# EAGLE design MegaBotv2 (EAGLE 9.6.2)
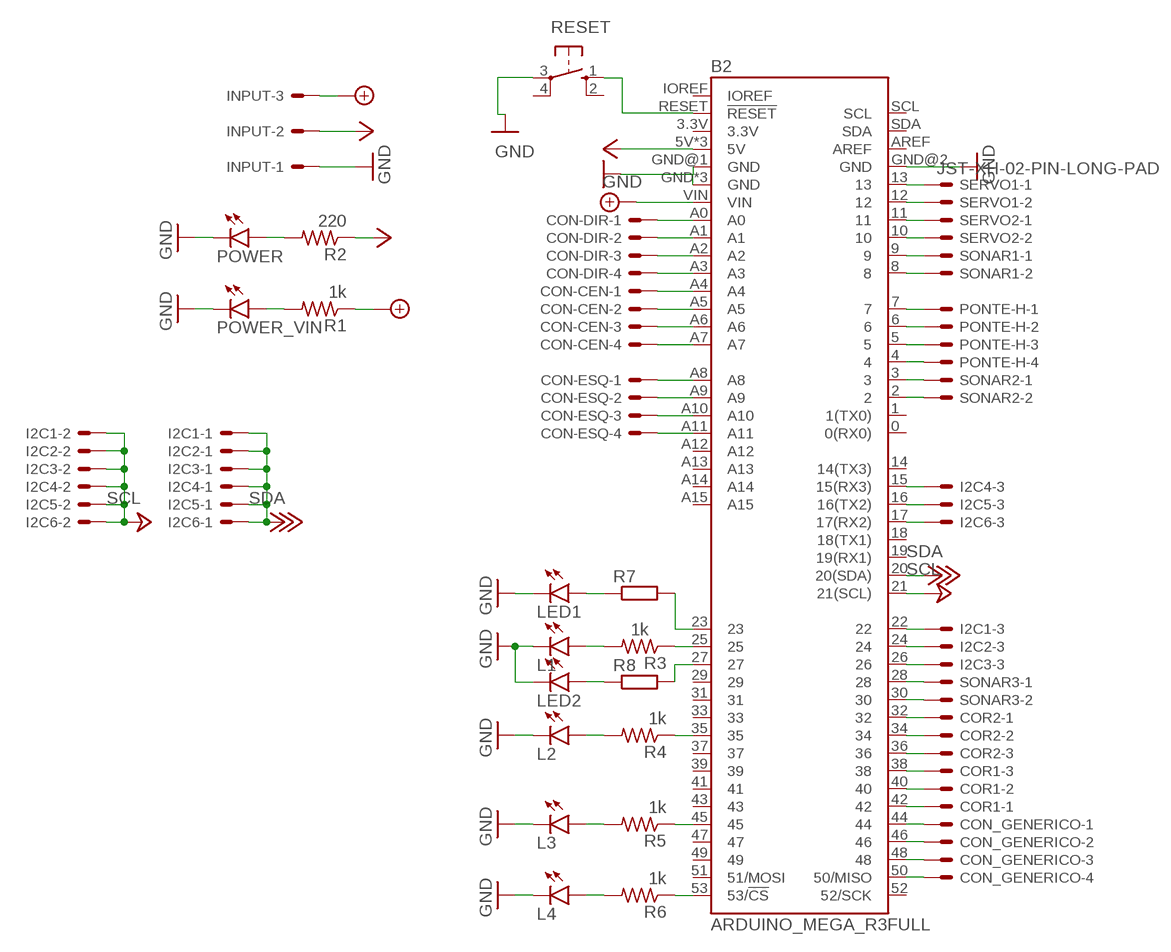
[diagram p0: schematic, sheet 1]

## Parts
B2  ARDUINO_MEGA_R3FULL  [ARDUINO_MEGA_NO_SILK]
CON-CEN  JST-XH-04-PIN-LONG-PAD  [JST-XH-04-PACKAGE-LONG-PAD]
CON-DIR  JST-XH-04-PIN-LONG-PAD  [JST-XH-04-PACKAGE-LONG-PAD]
CON-ESQ  JST-XH-04-PIN-LONG-PAD  [JST-XH-04-PACKAGE-LONG-PAD]
CON_GENERICO  JST-XH-04-PIN-LONG-PAD  [JST-XH-04-PACKAGE-LONG-PAD]
COR1  JST-XH-03-PIN-LONG-PAD  [JST-XH-03-PACKAGE-LONG-PAD]
COR2  JST-XH-03-PIN-LONG-PAD  [JST-XH-03-PACKAGE-LONG-PAD]
I2C1  JST-XH-03-PIN-LONG-PAD  [JST-XH-03-PACKAGE-LONG-PAD]
I2C2  JST-XH-03-PIN-LONG-PAD  [JST-XH-03-PACKAGE-LONG-PAD]
I2C3  JST-XH-03-PIN-LONG-PAD  [JST-XH-03-PACKAGE-LONG-PAD]
I2C4  JST-XH-03-PIN-LONG-PAD  [JST-XH-03-PACKAGE-LONG-PAD]
I2C5  JST-XH-03-PIN-LONG-PAD  [JST-XH-03-PACKAGE-LONG-PAD]
I2C6  JST-XH-03-PIN-LONG-PAD  [JST-XH-03-PACKAGE-LONG-PAD]
INPUT  KK-156-3  [KK-156-3]
L1  LEDLED5MM_LONG_PAD  [LED5MM_LONG_PAD]
L2  LEDLED5MM_LONG_PAD  [LED5MM_LONG_PAD]
L3  LEDLED5MM_LONG_PAD  [LED5MM_LONG_PAD]
L4  LEDLED5MM_LONG_PAD  [LED5MM_LONG_PAD]
LED1  LEDKA-3528ASYC  [KA-3528ASYC]
LED2  LEDKA-3528ASYC  [KA-3528ASYC]
PONTE-H  JST-XH-04-PIN-LONG-PAD  [JST-XH-04-PACKAGE-LONG-PAD]
POWER  LEDLED5MM_LONG_PAD  [LED5MM_LONG_PAD]
POWER_VIN  LEDLED5MM_LONG_PAD  [LED5MM_LONG_PAD]
R1  1k  R-US_0204/7  [0204/7]
R2  220  R-US_0204/7  [0204/7]
R3  1k  R-US_0204/7  [0204/7]
R4  1k  R-US_0204/7  [0204/7]
R5  1k  R-US_0204/7  [0204/7]
R6  1k  R-US_0204/7  [0204/7]
R7  R-EU_M0805  [M0805]
R8  R-EU_M0805  [M0805]
RESET  10-XX  [B3F-10XX]
SERVO1  JST-XH-02-PIN-LONG-PAD  [JST-XH-02-PACKAGE-LONG-PAD]
SERVO2  JST-XH-02-PIN-LONG-PAD  [JST-XH-02-PACKAGE-LONG-PAD]
SONAR1  JST-XH-02-PIN-LONG-PAD  [JST-XH-02-PACKAGE-LONG-PAD]
SONAR2  JST-XH-02-PIN-LONG-PAD  [JST-XH-02-PACKAGE-LONG-PAD]
SONAR3  JST-XH-02-PIN-LONG-PAD  [JST-XH-02-PACKAGE-LONG-PAD]

## Nets
+8V: B2.VIN INPUT.3 R1.1
+18V: B2.20(20(SDA)) I2C1.1 I2C2.1 I2C3.1 I2C4.1 I2C5.1 I2C6.1 ; supply symbol labelled SDA
+24V: B2.21(21(SCL)) I2C1.2 I2C2.2 I2C3.2 I2C4.2 I2C5.2 I2C6.2 ; supply symbol labelled SCL
GND: B2.GND B2.GND@1(GND) B2.GND@2(GND) B2.GND@3(GND) B2.GND@4(GND) INPUT.1 L1.K(C) L2.K(C) L3.K(C) L4.K(C) LED1.C LED2.C POWER.K(C) POWER_VIN.K(C) RESET.3(P)
N$1: B2.7 PONTE-H.1
N$2: B2.6 PONTE-H.2
N$3: B2.5 PONTE-H.3
N$4: B2.4 PONTE-H.4
N$5: B2.A1 CON-DIR.2
N$6: B2.A2 CON-DIR.3
N$7: B2.A3 CON-DIR.4
N$8: B2.A4 CON-CEN.1
N$9: B2.A5 CON-CEN.2
N$10: B2.A6 CON-CEN.3
N$11: B2.A0 CON-DIR.1
N$12: B2.A7 CON-CEN.4
N$13: B2.A8 CON-ESQ.1
N$14: B2.A9 CON-ESQ.2
N$15: B2.A10 CON-ESQ.3
N$16: B2.A11 CON-ESQ.4
N$17: B2.11 SERVO2.1
N$18: B2.10 SERVO2.2
N$19: B2.9 SONAR1.1
N$20: B2.8 SONAR1.2
N$21: B2.22 I2C1.3
N$22: B2.24 I2C2.3
N$23: B2.26 I2C3.3
N$24: B2.15(15(RX3)) I2C4.3
N$25: B2.16(16(TX2)) I2C5.3
N$26: B2.17(17(RX2)) I2C6.3
N$27: B2.13 SERVO1.1
N$28: B2.12 SERVO1.2
N$29: POWER_VIN.A R1.2
N$30: B2.32 COR2.1
N$31: B2.34 COR2.2
N$32: POWER.A R2.2
N$33: B2.36 COR2.3
N$34: B2.38 COR1.3
N$35: B2.40 COR1.2
N$36: B2.42 COR1.1
N$37: L1.A R3.2
N$38: L2.A R4.2
N$39: L3.A R5.2
N$40: L4.A R6.2
N$41: B2.25 R3.1
N$42: B2.35 R4.1
N$43: B2.45 R5.1
N$44: B2.53(53/!CS) R6.1
N$45: B2.RESET(!RESET) RESET.1(S)
N$46: B2.3 SONAR2.1
N$47: B2.2 SONAR2.2
N$48: B2.28 SONAR3.1
N$49: B2.30 SONAR3.2
N$50: B2.44 CON_GENERICO.1
N$51: B2.46 CON_GENERICO.2
N$52: B2.48 CON_GENERICO.3
N$53: B2.50(50/MISO) CON_GENERICO.4
N$54: LED1.A R7.1
N$55: B2.23 R7.2
N$56: B2.27 R8.2
N$57: LED2.A R8.1
VCC: B2.5V B2.5V@1(5V) B2.5V@2(5V) INPUT.2 R2.1
Unconnected: B2.0(0(RX0)) B2.1(1(TX0)) B2.3.3V B2.14(14(TX3)) B2.18(18(TX1)) B2.19(19(RX1)) B2.29 B2.31 B2.33 B2.37 B2.39 B2.41 B2.43 B2.47 B2.49 B2.51(51/MOSI) B2.52(52/SCK) B2.A12 B2.A13 B2.A14 B2.A15 B2.AREF B2.IOREF B2.SCL B2.SDA RESET.2(S1) RESET.4(P1)

## Library data of the parts
B2 = SparkFun-Boards:ARDUINO_MEGA_R3: Arduino Mega R3 ATmega2560 R3 compatible footprint. SparkFun Products: Arduino Mega 2560 R3 <https://www.sparkfun.com/products/11061>
CON-CEN CON-DIR CON-ESQ CON_GENERICO PONTE-H = Rembrandt Electronics - JST XH Connectors v1-0:JST-XH-04-PIN: JST XH Connector 2 Pin Wire to board connector. Pitch: 2,54 mm, (0.100") Number of pins: 4 Created by Rembrandt Electronics www.rembrandtelectronics.com
COR1 COR2 I2C1-I2C6 = Rembrandt Electronics - JST XH Connectors v1-0:JST-XH-03-PIN: JST XH Connector 2 Pin Wire to board connector. Pitch: 2,54 mm, (0.100") Number of pins: 3 Created by Rembrandt Electronics www.rembrandtelectronics.com
INPUT = con-molex:KK-156-3: KK 156 HEADER Source: http://www.molex.com/pdm_docs/sd/026604100_sd.pdf; MF: MOLEX; OC_FARNELL: unknown; OC_NEWARK: unknown
L1-L4 POWER POWER_VIN = led_robotica:LED: LED OSRAM: - CHIPLED LG R971, LG N971, LY N971, LG Q971, LY Q971, LO R971, LY R971 LH N974, LH R974 LS Q976, LO Q976, LY Q976 LO Q996 - Hyper CHIPLED LW Q18S LB Q993, LB Q99A, LB R99A - SideLED LS A670, LO A670, LY A670, LG A670, LP A670 LB A673, LV A673, LT A673, LW A673 LH A674 LY A675 LS A676, LA A676, LO A676, LY A676, LW A676 LS A679, LY A679, LG A679 - Hyper Micro SIDELED® LS Y876, LA Y876, LO Y876, LY Y876 LT Y87S - SmartLED LW L88C, LW L88S LB L89C, LB L89S, LG L890 LS L89K, LO L89K, LY L89K LS L896, LA L896, LO L896, LY L896 - TOPLED LS T670, LO T670, LY T670, LG T670, LP T670 LSG T670, LSP T670, LSY T670, LOP T670, LYG T670 LG T671, LOG T671, LSG T671 LB T673, LV T673, LT T673, LW T673 LH T674 LS T676, LA T676, LO T676, LY T676, LB T676, LH T676, LSB T676, LW T676 LB T67C, LV T67C, LT T67C, LS T67K, LO T67K, LY T67K, LW E67C LS E67B, LA E67B, LO E67B, LY E67B, LB E67C, LV E67C, LT E67C LW T67C LS T679, LY T679, LG T679 LS T770, LO T770, LY T770, LG T770, LP T770 LB T773, LV T773, LT T773, LW T773 LH T774 LS E675, LA E675, LY E675, LS T675 LS T776, LA T776, LO T776, LY T776, LB T776 LHGB T686 LT T68C, LB T68C - Hyper Mini TOPLED® LB M676 - Mini TOPLED Santana® LG M470 LS M47K, LO M47K, LY M47K Source: http://www.osram.convergy.de LUXEON: - LUMILED® LXK2-PW12-R00, LXK2-PW12-S00, LXK2-PW14-U00, LXK2-PW14-V00 LXK2-PM12-R00, LXK2-PM12-S00, LXK2-PM14-U00 LXK2-PE12-Q00, LXK2-PE12-R00, LXK2-PE12-S00, LXK2-PE14-T00, LXK2-PE14-U00 LXK2-PB12-K00, LXK2-PB12-L00, LXK2-PB12-M00, LXK2-PB14-N00, LXK2-PB14-P00, LXK2-PB14-Q00 LXK2-PR12-L00, LXK2-PR12-M00, LXK2-PR14-Q00, LXK2-PR14-R00 LXK2-PD12-Q00, LXK2-PD12-R00, LXK2-PD12-S00 LXK2-PH12-R00, LXK2-PH12-S00 LXK2-PL12-P00, LXK2-PL12-Q00, LXK2-PL12-R00 Source: www.luxeon.com KINGBRIGHT: KA-3528ASYC Source: www.kingbright.com
LED1 LED2 = led:LED: LED OSRAM: - CHIPLED LG R971, LG N971, LY N971, LG Q971, LY Q971, LO R971, LY R971 LH N974, LH R974 LS Q976, LO Q976, LY Q976 LO Q996 - Hyper CHIPLED LW Q18S LB Q993, LB Q99A, LB R99A - SideLED LS A670, LO A670, LY A670, LG A670, LP A670 LB A673, LV A673, LT A673, LW A673 LH A674 LY A675 LS A676, LA A676, LO A676, LY A676, LW A676 LS A679, LY A679, LG A679 - Hyper Micro SIDELED® LS Y876, LA Y876, LO Y876, LY Y876 LT Y87S - SmartLED LW L88C, LW L88S LB L89C, LB L89S, LG L890 LS L89K, LO L89K, LY L89K LS L896, LA L896, LO L896, LY L896 - TOPLED LS T670, LO T670, LY T670, LG T670, LP T670 LSG T670, LSP T670, LSY T670, LOP T670, LYG T670 LG T671, LOG T671, LSG T671 LB T673, LV T673, LT T673, LW T673 LH T674 LS T676, LA T676, LO T676, LY T676, LB T676, LH T676, LSB T676, LW T676 LB T67C, LV T67C, LT T67C, LS T67K, LO T67K, LY T67K, LW E67C LS E67B, LA E67B, LO E67B, LY E67B, LB E67C, LV E67C, LT E67C LW T67C LS T679, LY T679, LG T679 LS T770, LO T770, LY T770, LG T770, LP T770 LB T773, LV T773, LT T773, LW T773 LH T774 LS E675, LA E675, LY E675, LS T675 LS T776, LA T776, LO T776, LY T776, LB T776 LHGB T686 LT T68C, LB T68C - Hyper Mini TOPLED® LB M676 - Mini TOPLED Santana® LG M470 LS M47K, LO M47K, LY M47K Source: http://www.osram.convergy.de LUXEON: - LUMILED® LXK2-PW12-R00, LXK2-PW12-S00, LXK2-PW14-U00, LXK2-PW14-V00 LXK2-PM12-R00, LXK2-PM12-S00, LXK2-PM14-U00 LXK2-PE12-Q00, LXK2-PE12-R00, LXK2-PE12-S00, LXK2-PE14-T00, LXK2-PE14-U00 LXK2-PB12-K00, LXK2-PB12-L00, LXK2-PB12-M00, LXK2-PB14-N00, LXK2-PB14-P00, LXK2-PB14-Q00 LXK2-PR12-L00, LXK2-PR12-M00, LXK2-PR14-Q00, LXK2-PR14-R00 LXK2-PD12-Q00, LXK2-PD12-R00, LXK2-PD12-S00 LXK2-PH12-R00, LXK2-PH12-S00 LXK2-PL12-P00, LXK2-PL12-Q00, LXK2-PL12-R00 Source: www.luxeon.com KINGBRIGHT: KA-3528ASYC Source: www.kingbright.com
R1-R6 = rcl_robotica:R-US_: RESISTOR, American symbol; SPICEPREFIX: R
R7 R8 = rcl:R-EU_: RESISTOR, European symbol; SPICEPREFIX: R
RESET = switch-omron:10-XX: OMRON SWITCH; MPN: B3F-1000; OC_FARNELL: 176432; OC_NEWARK: 36M3542
SERVO1 SERVO2 SONAR1-SONAR3 = Rembrandt Electronics - JST XH Connectors v1-0:JST-XH-02-PIN: JST XH Connector 2 Pin Wire to board connector. Pitch: 2,54 mm, (0.100") Number of pins: 2 Created by Rembrandt Electronics www.rembrandtelectronics.com

## Board
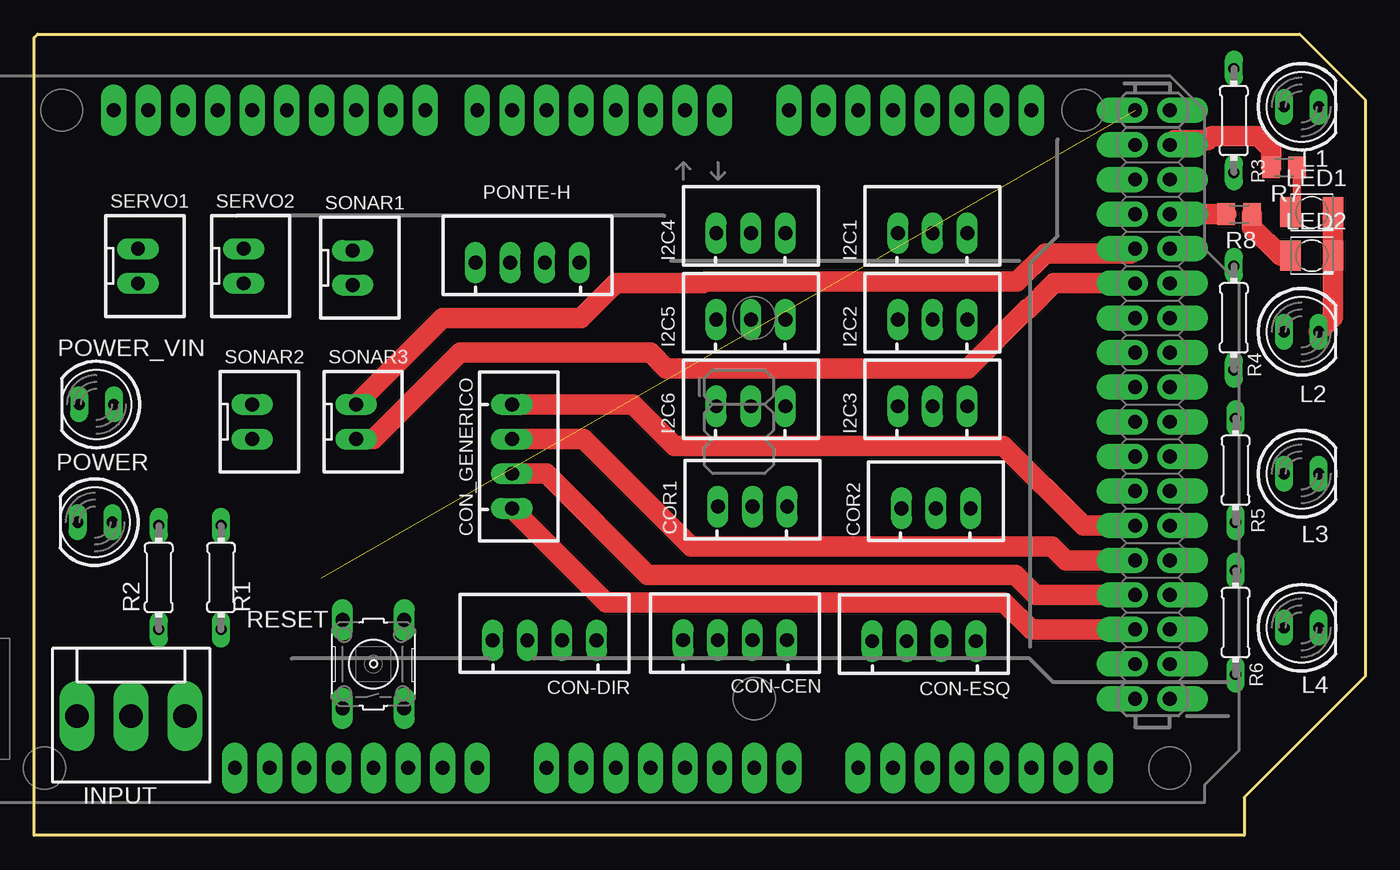
[diagram p1: board, top side]
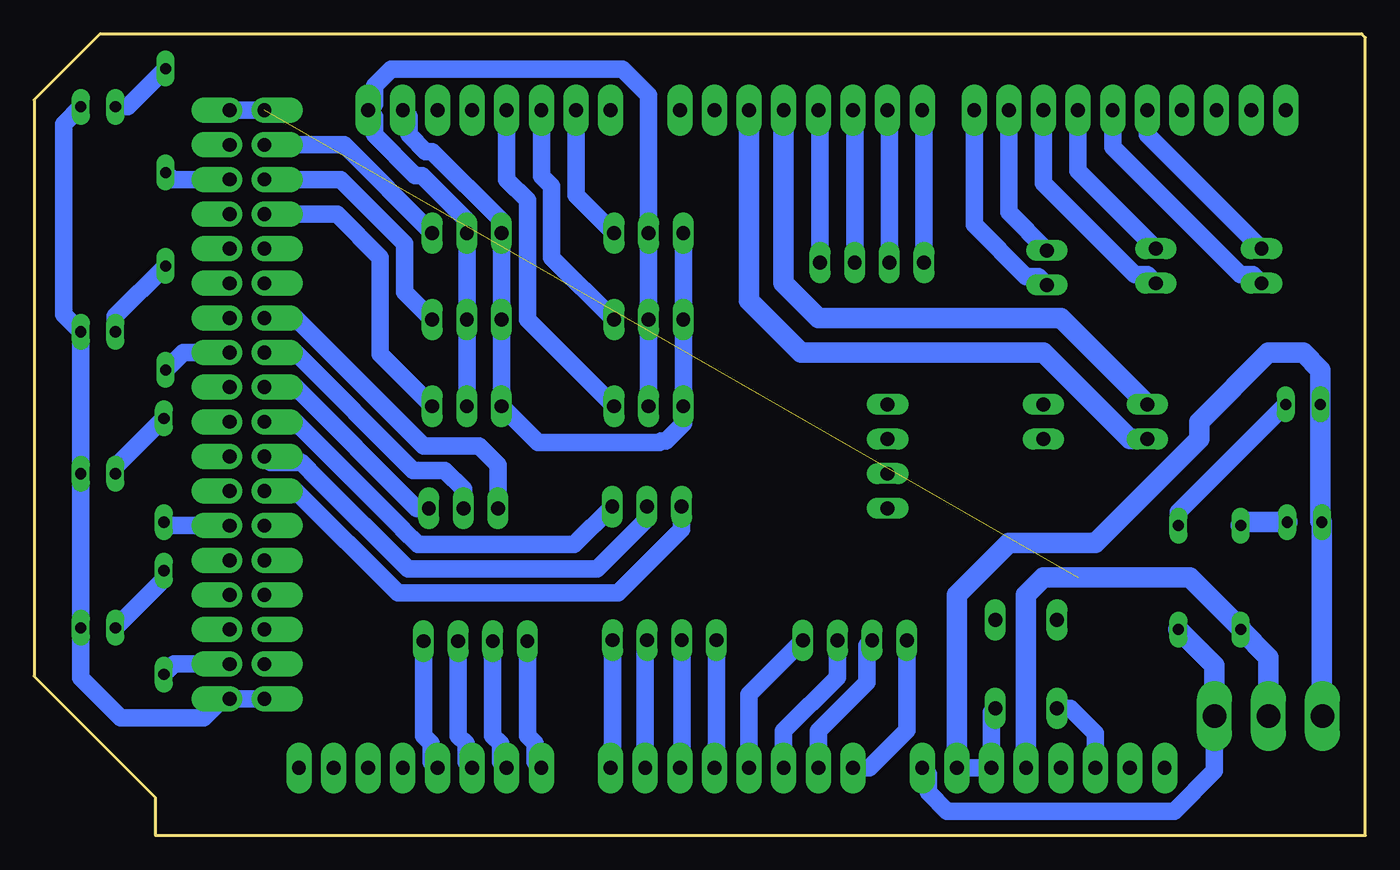
[diagram p2: board, bottom side, seen from below]

Size 97.66 x 58.8 mm. Coordinates in mm from the lower left corner, seen from the top.
Outline: 0,0 0,58.55 0.25,58.8 92.84,58.8 97.66,53.98 97.66,11.68 88.77,2.79 88.77,0 0,0
Copper layers (1*16): Top 0.035mm / dielectric 1.5mm / Bottom 0.035mm
Design rules "default *": minimum track width 0.032259375mm, minimum drill 0.35mm, track to track 20mil, track to pad 20mil, pad to pad 20mil, via to via 20mil, smd to smd 6mil, copper to edge 40mil, drill to drill 6mil, minimum pad ring 10mil, minimum via ring 8mil, stop-mask expansion 4mil, vias tented up to drill 0mil, thermal gap 10mil

### Footprints (pad centres in the part's own frame; a part is rotated, then mirrored left to right if it is on the bottom)
ARDUINO_MEGA_NO_SILK = drill 1.016 pad 1.88 long: 0 13.97,24.13; 1 11.43,24.13; 2 8.89,24.13; 3 6.35,24.13; 3.3V -13.97,-24.13; 4 3.81,24.13; 5 1.27,24.13; 5V -11.43,-24.13; 6 -1.27,24.13; 7 -3.81,24.13; 8 -7.62,24.13; 9 -10.16,24.13; 10 -12.7,24.13; 11 -15.24,24.13; 12 -17.78,24.13; 13 -20.32,24.13; 14 19.05,24.13; 15 21.59,24.13; 16 24.13,24.13; 17 26.67,24.13; 18 29.21,24.13; 19 31.75,24.13; 20 34.29,24.13; 21 36.83,24.13; A0 1.27,-24.13; A1 3.81,-24.13; A2 6.35,-24.13; A3 8.89,-24.13; A4 11.43,-24.13; A5 13.97,-24.13; A6 16.51,-24.13; A7 19.05,-24.13; A8 24.13,-24.13; A9 26.67,-24.13; A10 29.21,-24.13; A11 31.75,-24.13; A12 34.29,-24.13; A13 36.83,-24.13; A14 39.37,-24.13; A15 41.91,-24.13; AREF -25.4,24.13; GND -8.89,-24.13; GND@1 -6.35,-24.13; GND@4 -22.86,24.13; IOREF -19.05,-24.13; NC -21.59,-24.13; RESET -16.51,-24.13; SCL -30.48,24.13; SDA -27.94,24.13; VIN -3.81,-24.13 | drill 1.016 pad 1.88 offset: 5V@1 44.45,24.13; 5V@2 46.99,24.13; 22 44.45,21.59; 23 46.99,21.59; 24 44.45,19.05; 25 46.99,19.05; 26 44.45,16.51; 27 46.99,16.51; 28 44.45,13.97; 29 46.99,13.97; 30 44.45,11.43; 31 46.99,11.43; 32 44.45,8.89; 33 46.99,8.89; 34 44.45,6.35; 35 46.99,6.35; 36 44.45,3.81; 37 46.99,3.81; 38 44.45,1.27; 39 46.99,1.27; 40 44.45,-1.27; 41 46.99,-1.27; 42 44.45,-3.81; 43 46.99,-3.81; 44 44.45,-6.35; 45 46.99,-6.35; 46 44.45,-8.89; 47 46.99,-8.89; 48 44.45,-11.43; 49 46.99,-11.43; 50 44.45,-13.97; 51 46.99,-13.97; 52 44.45,-16.51; 53 46.99,-16.51; GND@2 44.45,-19.05; GND@3 46.99,-19.05
JST-XH-04-PACKAGE-LONG-PAD = drill 1.016 long: 1 -3.81,0; 2 -1.27,0; 3 1.27,0; 4 3.81,0
JST-XH-03-PACKAGE-LONG-PAD = drill 1.016 long: 1 -2.54,0; 2 0,0; 3 2.54,0
KK-156-3 = drill 1.7 pad 2.184 long: 1 -3.96,0; 2 0,0; 3 3.96,0
LED5MM_LONG_PAD = drill 0.813 long: A -1.27,0; K 1.27,0
KA-3528ASYC = smd 1.5 x 2.2: A -1.55,0; C 1.55,0
0204/7 = drill 0.813 long: 1 -3.81,0; 2 3.81,0
M0805 = smd 1.3 x 1.6: 1 -0.95,0; 2 0.95,0
B3F-10XX = drill 1.016 long: 1 -3.251,2.261; 2 3.251,2.261; 3 -3.251,-2.261; 4 3.251,-2.261
JST-XH-02-PACKAGE-LONG-PAD = drill 1.016 long: 1 -1.27,0; 2 1.27,0

### Placement (x,y rotation side)
B2  36.32,29.08 0 top
CON-CEN  51.42,14.33 0 top
CON-DIR  37.45,14.31 0 top
CON-ESQ  65.29,14.26 0 top
CON_GENERICO  35.05,27.81 270 top
COR1  52.7,24.13 0 top
COR2  66.17,24 0 top
I2C1  65.91,44.2 0 top
I2C2  65.91,37.85 0 top
I2C3  65.91,31.5 0 top
I2C4  52.58,44.2 0 top
I2C5  52.58,37.85 0 top
I2C6  52.58,31.5 0 top
INPUT  7.11,8.76 0 top
L1  92.96,53.47 0 top
L2  92.96,36.96 0 top
L3  92.96,26.54 0 top
L4  92.96,15.24 0 top
LED1  93.73,45.72 0 top
LED2  93.73,42.55 0 top
PONTE-H  36.2,42.04 0 top
POWER  4.47,22.99 180 top
POWER_VIN  4.57,31.62 180 top
R1  13.72,18.92 90 top
R2  9.14,18.92 90 top
R3  88.01,52.45 90 top
R4  88.01,37.97 90 top
R5  88.14,26.8 90 top
R6  88.14,15.62 90 top
R7  91.69,49.02 180 top
R8  88.39,45.59 180 top
RESET  24.89,12.57 90 top
SERVO1  7.62,41.78 270 top
SERVO2  15.37,41.78 270 top
SONAR1  23.37,41.66 270 top
SONAR2  16,30.35 270 top
SONAR3  23.62,30.35 270 top

### Tracks (layer width: path | path; a pad name or v marks a point on that pad's centre or on a via)
+8V
  Bottom 1.27: B2.VIN 32.06,4.5 32.06,3.15 30.68,1.78 14.02,1.78 11.07,4.73 INPUT.3
  Bottom 1.5: R1.1 11.07,12.47 INPUT.3
+18V
  Bottom 1.27: I2C4.1 I2C5.1 I2C6.1 50.04,30.23 51.31,28.96 51.66,28.96 51.79,28.83 60.71,28.83 I2C3.1 I2C2.1 I2C1.1 63.37,45.11 68.45,50.19 68.94,50.19 70.16,51.41 70.16,52.76 B2.20
+24V
  Bottom 1.27: I2C3.2 I2C2.2 I2C1.2 65.91,45.11 69.21,48.41 69.7,48.41 72.7,51.41 72.7,52.76 B2.21 72.7,53.67 72.7,55.02 71.48,56.24 54.51,56.24 52.58,54.3 I2C4.2 I2C5.2 I2C6.2
GND
  Top 1.5: LED1.C LED2.C 95.28,38 L2.K
  Bottom 1.27: B2.GND@2 B2.GND@3 83.82,10.03 85.22,8.64 91.31,8.64 94.23,11.56 L4.K L3.K L2.K 95.5,38.23 95.5,52.2 L1.K | B2.GND@1 B2.GND 27.43,9.04 RESET.3 | 3.2,31.52 POWER_VIN.K
  Bottom 1.5: B2.GND@1 29.97,17.65 26.16,21.46 19.81,21.46 12.19,29.08 12.19,30.35 7.11,35.43 4.57,35.43 3.3,34.16 POWER_VIN.K 3.3,23.09 POWER.K 3.2,8.81 INPUT.1
N$1
  Bottom 1.27: B2.7 32.39,53.09 PONTE-H.1
N$2
  Bottom 1.27: B2.6 34.92,53.09 PONTE-H.2
N$3
  Bottom 1.27: B2.5 37.47,53.09 PONTE-H.3
N$4
  Bottom 1.27: B2.4 40,53.09 PONTE-H.4
N$5
  Bottom 1.27: CON-DIR.2 36.56,13.93 36.56,11.24 40.13,7.67 B2.A1
N$6
  Bottom 1.27: CON-DIR.3 38.72,11.62 42.67,7.67 B2.A2
N$7
  Bottom 1.27: CON-DIR.4 45.21,10.36 B2.A3
N$8
  Bottom 1.27: B2.A4 47.61,5.1 CON-CEN.1
N$9
  Bottom 1.27: CON-CEN.2 50.15,5.1 B2.A5
N$10
  Bottom 1.27: CON-CEN.3 52.83,14.19 B2.A6
N$11
  Bottom 1.27: CON-DIR.1 33.64,7.71 36.4,4.95 B2.A0
N$12
  Bottom 1.27: CON-CEN.4 55.23,5.1 B2.A7
N$13
  Bottom 1.27: B2.A8 60.91,5.41 60.91,6.76 61.48,7.32 CON-ESQ.1
N$14
  Bottom 1.27: B2.A9 63.45,5.41 63.45,6.76 64.02,7.32 CON-ESQ.2
N$15
  Bottom 1.27: B2.A10 65.99,5.41 65.99,6.76 66.56,7.32 CON-ESQ.3
N$16
  Bottom 1.27: B2.A11 68.53,5.41 68.53,6.76 69.1,7.32 CON-ESQ.4
N$17
  Bottom 1.27: B2.11 21.08,48.77 SERVO2.1
N$18
  Bottom 1.27: SERVO2.2 16,41.15 16.92,41.15 23.62,47.85 B2.10
N$19
  Bottom 1.27: B2.9 26.16,45.72 SONAR1.1
N$20
  Bottom 1.27: SONAR1.2 24,41.02 24.92,41.02 28.7,44.8 B2.8
N$21
  Bottom 1.27: I2C1.3 74.93,50.67 B2.22
N$22
  Bottom 1.27: I2C2.3 70.48,39.88 70.48,43.43 75.18,48.13 B2.24
N$23
  Bottom 1.27: I2C3.3 72.26,35.31 72.26,42.42 75.44,45.59 B2.26
N$24
  Bottom 1.27: B2.15 57.91,46.99 I2C4.3
N$25
  Bottom 1.27: B2.16 60.45,48.39 59.69,47.62 59.69,42.42 I2C5.3
N$26
  Bottom 1.27: B2.17 62.99,48.13 61.47,46.61 61.47,37.85 I2C6.3
N$27
  Bottom 1.27: B2.13 16,51.44 SERVO1.1
N$28
  Bottom 1.27: SERVO1.2 8.25,41.15 9.17,41.15 18.54,50.52 B2.12
N$29
  Bottom 1.27: R1.2 13.72,23.75 POWER_VIN.A
N$30
  Bottom 1.27: COR2.1 63.63,27.18 65.03,28.58 69.09,28.58 78.49,37.97 B2.32
N$31
  Bottom 1.27: COR2.2 66.17,25.43 67.54,26.8 69.85,26.8 78.49,35.43 B2.34
N$32
  Bottom 1.5: POWER.A 8.89,22.99 R2.2
N$33
  Bottom 1.27: COR2.3 69.6,24 78.49,32.89 B2.36
N$34
  Bottom 1.27: COR1.3 58.04,21.34 69.5,21.34 70.61,22.45 70.61,22.51 78.46,30.35 B2.38
N$35
  Bottom 1.27: COR1.2 52.7,23.21 56.36,19.56 70.23,19.56 76.81,26.14 78.03,27.36 80.31,27.36 B2.40
N$36
  Bottom 1.27: COR1.1 50.17,22.45 54.84,17.78 70.97,17.78 78.46,25.27 B2.42
N$37
  Bottom 1.27: R3.2 90.81,53.47 L1.A
N$38
  Bottom 1.27: R4.2 91.69,38.1 L2.A
N$39
  Bottom 1.27: R5.2 91.69,27.05 L3.A
N$40
  Bottom 1.27: L4.A 88.14,18.8 R6.2
N$41
  Bottom 1.27: R3.1 87.5,48.13 B2.25
N$42
  Bottom 1.27: R4.1 86.74,35.43 B2.35
N$43
  Bottom 1.27: B2.45 87.88,22.73 R5.1
N$44
  Bottom 1.27: B2.53 87.38,12.57 R6.1
N$45
  Bottom 1.27: B2.RESET 19.81,7.49 21.64,9.32 RESET.1
N$46
  Bottom 1.5: B2.3 42.67,40.51 40.13,37.97 22.35,37.97 SONAR2.1
N$47
  Bottom 1.5: B2.2 45.21,39.24 41.4,35.43 23.62,35.43 17.27,29.08 SONAR2.2
N$48
  Top 1.5: B2.28 80.43,42.71 74.17,42.71 72.09,40.63 49.2,40.63 49.09,40.51 42.67,40.51 40.13,37.97 29.97,37.97 SONAR3.1
N$49
  Top 1.5: B2.30 74.81,40.51 72.92,38.62 72.85,38.62 68.5,34.28 46.37,34.28 45.21,35.43 31.24,35.43 24.89,29.08 SONAR3.2
N$50
  Top 1.5: B2.44 76.96,22.73 71.12,28.58 46.99,28.58 43.94,31.62 CON_GENERICO.1
N$51
  Top 1.5: B2.46 75.69,20.19 74.66,21.22 48.19,21.22 40.32,29.08 CON_GENERICO.2
N$52
  Top 1.5: B2.48 73.45,17.65 71.98,19.12 45.01,19.12 37.59,26.54 CON_GENERICO.3
N$53
  Top 1.5: B2.50 73.15,15.11 71.15,17.12 41.94,17.12 CON_GENERICO.4
N$54
  Top 0.61: R7.1 92.64,46.19 LED1.A
N$55
  Top 1.5: R7.2 90.74,50.35 89.79,51.31 86.4,51.31 86.1,51.02 83.65,51.02 B2.23
N$56
  Top 1.5: R8.2 B2.27
N$57
  Top 1.5: R8.1 89.34,44.64 91.44,42.55 LED2.A
VCC  (1 unrouted)
  Bottom 1.27: B2.5V@1 B2.5V@2 | 21.25,18.92 21.22,18.9 21.06,18.9
  Bottom 1.5: INPUT.2 7.11,13.08 R2.1 9.11,15.15 12.88,18.92 21.25,18.92 23.62,18.92 24.89,17.65 B2.5V